# EAGLE design SparkFun NEO-M8U (EAGLE 9.6.2)
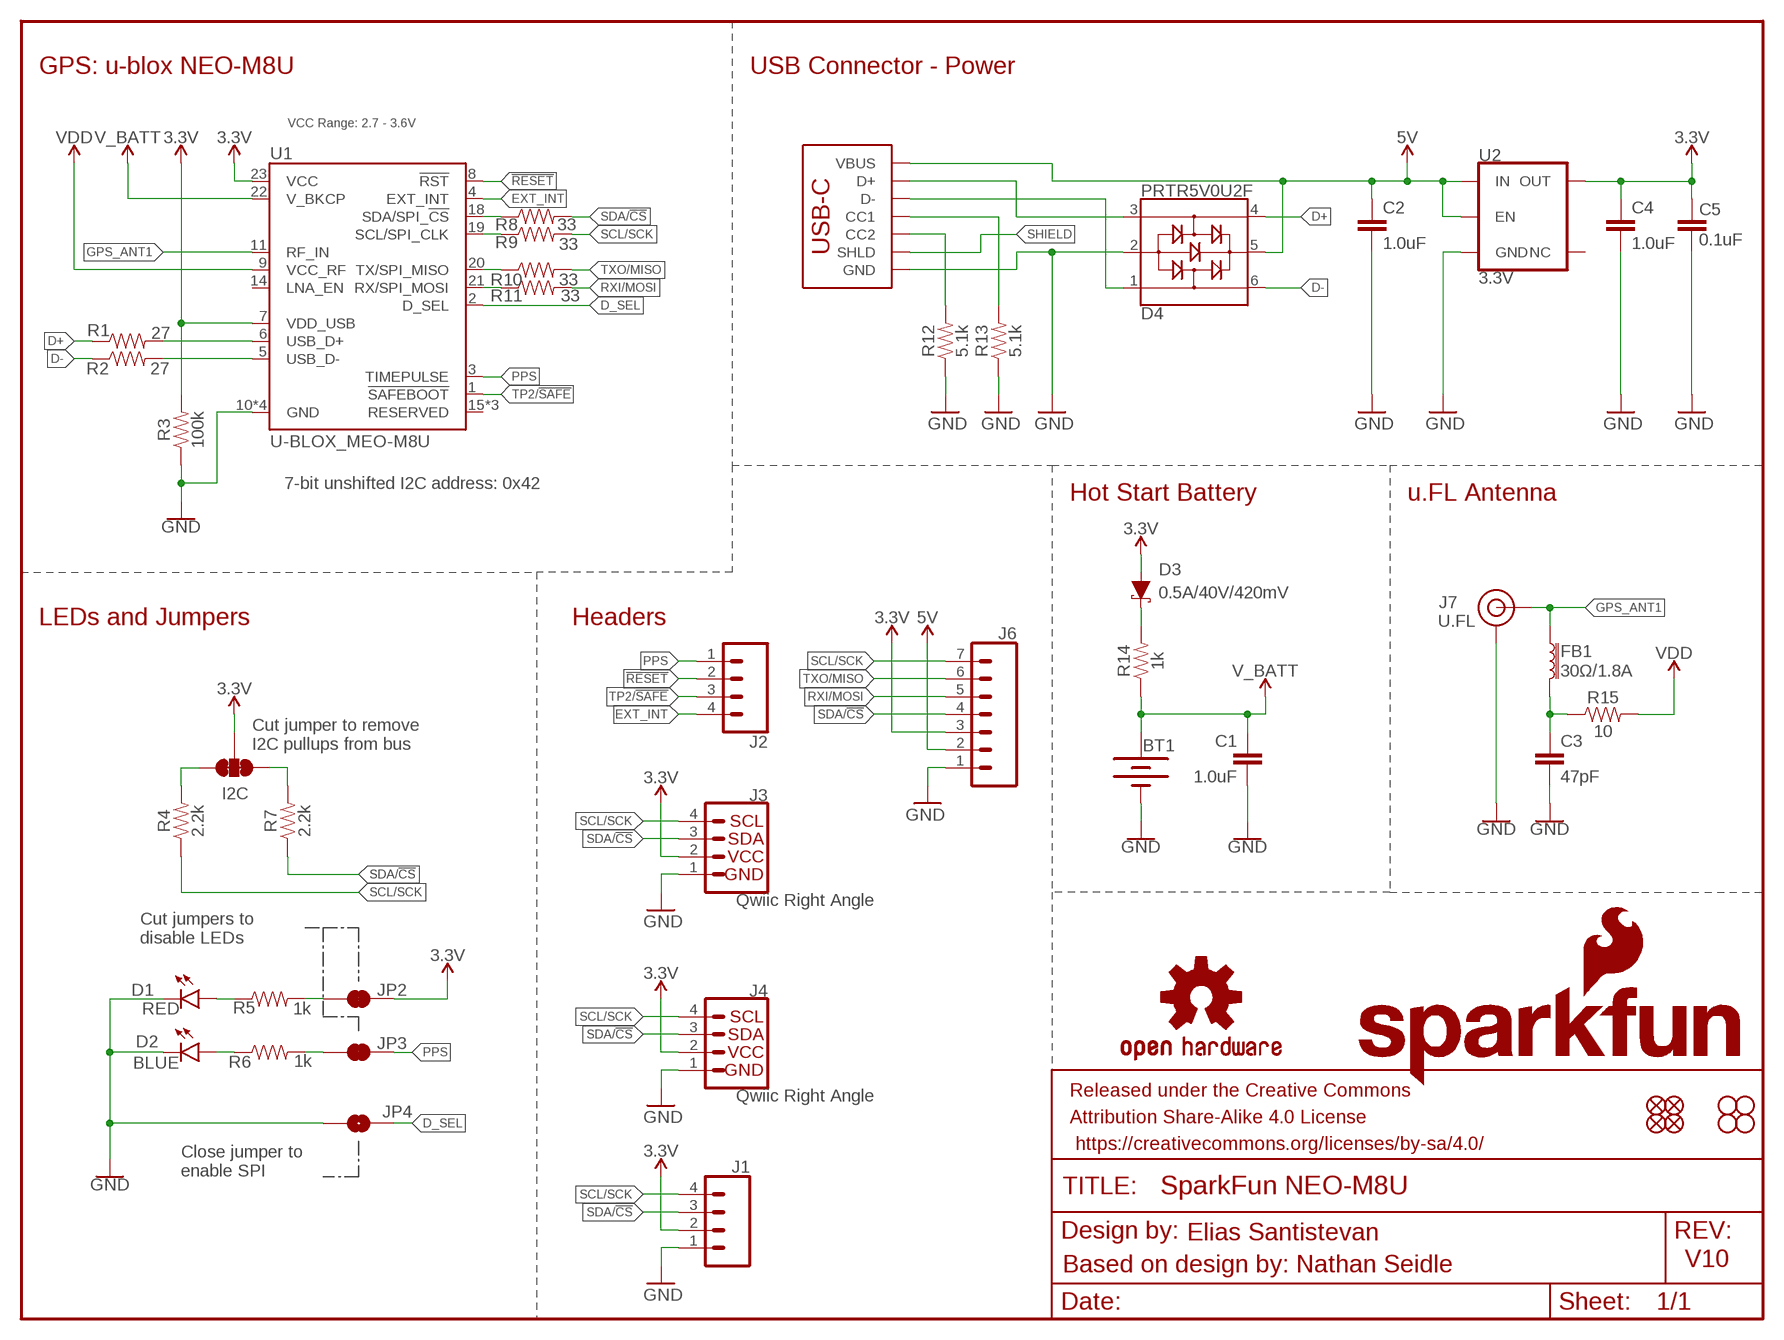
[diagram p0: schematic, sheet 1]

## Parts
BT1  6.8MM_COIN_CELL  ML414H_IV01E_BATTERY  [ML414H_IV01E]
C1  1.0uF  1.0UF-0603-16V-10%  [0603]
C2  1.0uF  1.0UF-0603-16V-10%  [0603]
C3  47pF  47PF-0603-50V-5%  [0603]
C4  1.0uF  1.0UF-0603-16V-10%  [0603]
C5  0.1uF  0.1UF-0603-25V-(+80/-20%)  [0603]
D1  RED  LED-RED0603  [LED-0603]
D2  BLUE  LED-BLUE0603  [LED-0603]
D3  0.5A/40V/420mV  DIODE-SCHOTTKY-PMEG4005EJ  [SOD-323]
D4  PRTR5V0U2F  [SOT886]
FB1  30Ω/1.8A  FERRITE_BEAD-0603  [0603]
FRAME1  FRAME-LETTER  [CREATIVE_COMMONS]
J1  CONN_041X04_NO_SILK  [1X04_NO_SILK]
J2  CONN_041X04_NO_SILK  [1X04_NO_SILK]
J3  Qwiic Right Angle  I2C_STANDARDQWIIC  [JST04_1MM_RA]
J4  Qwiic Right Angle  I2C_STANDARDQWIIC  [JST04_1MM_RA]
J5  USB_C_2-LAYER_PADS  [USB-C-16P-2LAYER-PADS]
J6  CONN_07NO_SILK  [1X07_NO_SILK]
J7  U.FL  U.FL2PIN  [U.FL]
JP1  JUMPER-SMT_3_2-NC_TRACE_SILK  [SMT-JUMPER_3_2-NC_TRACE_SILK]
JP2  JUMPER-SMT_2_NC_TRACE_SILK  [SMT-JUMPER_2_NC_TRACE_SILK]
JP3  JUMPER-SMT_2_NC_TRACE_SILK  [SMT-JUMPER_2_NC_TRACE_SILK]
JP4  JUMPER-SMT_2_NO_SILK  [SMT-JUMPER_2_NO_SILK]
JP5  FIDUCIALUFIDUCIAL  [MICRO-FIDUCIAL]
JP6  FIDUCIALUFIDUCIAL  [MICRO-FIDUCIAL]
JP7  FIDUCIALUFIDUCIAL  [MICRO-FIDUCIAL]
JP8  FIDUCIALUFIDUCIAL  [MICRO-FIDUCIAL]
JP9  STAND-OFF  [STAND-OFF]
JP10  STAND-OFF  [STAND-OFF]
JP11  STAND-OFF  [STAND-OFF]
JP12  STAND-OFF  [STAND-OFF]
LOGO1  OSHW-LOGOMINI  [OSHW-LOGO-MINI]
LOGO2  SFE_LOGO_NAME_FLAME.1_INCH  [SFE_LOGO_NAME_FLAME_.1]
R1  27  27OHM-0603-1/10W-1%  [0603]
R2  27  27OHM-0603-1/10W-1%  [0603]
R3  100k  100KOHM-0603-1/10W-1%  [0603]
R4  2.2k  2.2KOHM-0603-1/10W-1%  [0603]
R5  1k  1KOHM-0603-1/10W-1%  [0603]
R6  1k  1KOHM-0603-1/10W-1%  [0603]
R7  2.2k  2.2KOHM-0603-1/10W-1%  [0603]
R8  33  33OHM-0603-1/10W-1%  [0603]
R9  33  33OHM-0603-1/10W-1%  [0603]
R10  33  33OHM-0603-1/10W-1%  [0603]
R11  33  33OHM-0603-1/10W-1%  [0603]
R12  5.1k  5.1KOHM5.1KOHM-0603-1/10W-1%  [0603]
R13  5.1k  5.1KOHM5.1KOHM-0603-1/10W-1%  [0603]
R14  1k  1KOHM-0603-1/10W-1%  [0603]
R15  10  10OHM-0603-1/10W-1%  [0603]
U1  U-BLOX_MEO-M8U  [NEO-M9N/M8T/M8U]
U2  3.3V  V_REG_AP2112K-3.3V  [SOT23-5]

## Nets
3.3V [3.3V]: C4.1 C5.2 D3.A J1.2 J3.2 J4.2 J6.3 JP1.2 JP2.2 R3.2 U1.7(VDD_USB) U1.23(VCC) U2.5(OUT)
5V: C2.1 D4.5 J5.VBUS1(VBUS) J5.VBUS2(VBUS) J6.2 U2.1(IN) U2.3(EN)
!RESET: J2.2 U1.8(!RST)
ANT_VCC: C3.1 FB1.2 R15.1
D+: D4.4 R1.1
D-: D4.6 R2.1
D_SEL: JP4.2 U1.2(D_SEL)
EXT_INT: J2.4 U1.4(EXT_INT)
GND: BT1.- C1.2 C2.2 C3.2 C4.2 C5.1 D1.C D2.C D4.2 J1.1 J3.1 J4.1 J5.GND J5.GND2(GND) J6.1 J7.1(GND) J7.2(GND) JP4.1 R3.1 R12.1 R13.1 U1.10(GND) U1.12(GND) U1.13(GND) U1.24(GND) U2.2(GND)
GPS_ANT1: FB1.1 J7.FEED(SIGNAL) U1.11(RF_IN)
N$1: JP2.1 R5.2
N$2: D2.A R6.1
N$3: R8.1 U1.18(SDA/SPI_!CS!)
N$4: JP3.1 R6.2
N$5: JP1.1 R7.2
N$6: D3.C R14.2
N$7: J5.B5(CC2) R12.2
N$8: JP1.3 R4.2
N$9: J5.A5(CC1) R13.2
N$10: D1.A R5.1
N$11: R1.2 U1.6(USB_D+)
N$12: R2.2 U1.5(USB_D-)
N$13: R9.1 U1.19(SCL/SPI_CLK)
N$15: R10.1 U1.20(TX/SPI_MISO)
N$16: R11.1 U1.21(RX/SPI_MOSI)
PPS: J2.1 JP3.2 U1.3(TIMEPULSE)
RXI/MOSI: J6.5 R11.2
SCL/SCK: J1.4 J3.4 J4.4 J6.7 R4.1 R9.2
SDA/!CS: J1.3 J3.3 J4.3 J6.4 R7.1 R8.2
SHIELD: J5.SHLD1(SHLD) J5.SHLD2(SHLD) J5.SHLD3(SHLD) J5.SHLD4(SHLD)
TP2/!SAFE: J2.3 U1.1(!SAFEBOOT!)
TXO/MISO: J6.6 R10.2
USB_D+: D4.3 J5.A6(D+) J5.B6(D+)
USB_D-: D4.1 J5.A7(D-) J5.B7(D-)
V_BATT: BT1.+ C1.1 R14.1 U1.22(V_BKCP)
VDD: R15.2 U1.9(VCC_RF)
Unconnected: U1.14(LNA_EN) U1.15(RESERVED) U1.16(RESERVED) U1.17(RESERVED) U2.4(NC)

## Notes on the sheet
- GPS: u-blox NEO-M8U | USB Connector - Power
- VCC Range: 2.7 - 3.6V
- 7-bit unshifted I2C address: 0x42
- Hot Start Battery | u.FL Antenna
- LEDs and Jumpers | Headers
- Cut jumper to remove 
  I2C pullups from bus
- I2C
- Cut jumpers to 
  disable LEDs
- Close jumper to
  enable SPI
- Elias Santistevan
- Based on design by: Nathan Seidle | V10

## Library data of the parts
BT1 = SparkFun-Batteries:ML414H_IV01E_BATTERY: SEIKO ML414H-IV01E Reflowable Lithium Battery ML414H is a rechargeable, coin type battery with features such as Pb-free reflowable (Peak temperature: 260 C) and high temperature heat resistance. Battery Characteristics: 3.1V max voltage Voff is 2V 1mAH 3k series resistor with battery 72 hour charge time from 2.0-3.1V 2.3-2.8V initial charge; PROD_ID: BATT-14267
C1 C2 C4 = SparkFun-Capacitors:1.0UF: 1µF ceramic capacitors A capacitor is a passive two-terminal electrical component used to store electrical energy temporarily in an electric field.; PROD_ID: CAP-00868
C3 = SparkFun-Capacitors:47PF: 47pF ceramic capacitors A capacitor is a passive two-terminal electrical component used to store electrical energy temporarily in an electric field.; PROD_ID: CAP-08913
C5 = SparkFun-Capacitors:0.1UF: 0.1µF ceramic capacitors A capacitor is a passive two-terminal electrical component used to store electrical energy temporarily in an electric field.; PROD_ID: CAP-00810
D1 = SparkFun-LED:LED-RED: Red SMD LED Used in manufacturing of most products at SparkFun Packages: 0603 - SMD 0603 package [Product Link] <http://docs.avagotech.com/docs/AV02-0551EN> 0603 SMART - SMD 0603 SMART package ( more efficient and expensive)[Product Link] <http://www.osram-os.com/Graphics/XPic2/00077099_0.pdf> 1206 - SMD1206 package [Product Link] <https://www.sparkfun.com/datasheets/DevTools/LilyPad/Q150OVS4.pdff> SparkFun Products: Pro Mini 328 -5V <https://www.sparkfun.com/products/821> RedBoard <https://www.sparkfun.com/products/12757> IOIO-OTG <https://www.sparkfun.com/products/13613>; PROD_ID: DIO-00819
D2 = SparkFun-LED:LED-BLUE: Blue SMD LED Used in manufacturing of various products at SparkFun Packages: 0603 - SMD 0603 package [Product Link] <http://www.digikey.com/product-detail/en/SMLE12BC7TT86/511-1589-2-ND/1641808> 1206 - SMD1206 package [Product Link] <http://www.digikey.com/product-detail/en/lite-on-inc/LTST-C150TBKT/160-1643-1-ND/573584> SparkFun Products: ESP8266 Thing-Dev Board <https://www.sparkfun.com/products/13711> RedBoard <https://www.sparkfun.com/products/12757>; PROD_ID: DIO-08575
D3 = SparkFun-DiscreteSemi:DIODE-SCHOTTKY: Schottky diode A Schottky diode is a semiconductor diode which has a low forward voltage drop and a very fast switching action.; PROD_ID: DIO-10955
D4 = SparkFun-IC-Power:PRTR5V0U2: A small ESD protection device. Most commonly used on USB D+/D- signals to protect large, expensive, or especially sensitive USB enabled devices.; PROD_ID: DIO-14084
FB1 = SparkFun-Coils:FERRITE_BEAD: Ferrite Bead (blocks, cores, rings, chokes, etc.) Inductor with layers of ferrite used to suppress high frequencies. Often used to isolate high frequency noise. SparkFun Products: IOIO-OTG - V2.2 <https://www.sparkfun.com/products/13613> SparkFun SAMD21 Mini Breakout <https://www.sparkfun.com/products/13664> SparkFun 6 Degrees of Freedom Breakout - LSM6DS3 <https://www.sparkfun.com/products/13339> SparkFun SAMD21 Dev Breakout <https://www.sparkfun.com/products/13672>; PROD_ID: NDUC-13805
FRAME1 = SparkFun-Aesthetics:FRAME-LETTER: Schematic Frame - Letter Standard 8.5x11 US Letter frame
J1 J2 = SparkFun-Connectors:CONN_04: Multi connection point. Often used as Generic Header-pin footprint for 0.1 inch spaced/style header connections On any of the 0.1 inch spaced packages, you can populate with these: Break Away Headers - Straight <https://www.sparkfun.com/products/116> (PRT-00116) Break Away Male Headers - Right Angle <https://www.sparkfun.com/products/553> (PRT-00553) Female Headers <https://www.sparkfun.com/products/115> (PRT-00115) Break Away Headers - Machine Pin <https://www.sparkfun.com/products/117> (PRT-00117) Break Away Female Headers - Swiss Machine Pin <https://www.sparkfun.com/products/743> (PRT-00743) For SCREWTERMINALS and SPRING TERMINALS visit here: Screw Terimnals on SparkFun.com <https://www.sparkfun.com/search/results?term=Screw+Terminals> (5mm/3.5mm/2.54mm spacing) This device is also useful as a general connection point to wire up your design to another part of your project. Our various solder wires solder well into these plated through hole pads. Hook-Up Wire - Assortment (Stranded, 22 AWG) <https://www.sparkfun.com/products/11375> (PRT-11375) Hook-Up Wire - Assortment (Solid Core, 22 AWG) <https://www.sparkfun.com/products/11367> (PRT-11367) View the entire wire category on our website here <https://www.sparkfun.com/categories/141> Special notes: Molex polarized connector foot print use with SKU : PRT-08231 with associated crimp pins and housings. 1MM SMD Version SKU: PRT-10208; PROD_ID: CONN-09696
J3 J4 = SparkFun-Connectors:I2C_STANDARD: SparkFun I2C Standard Pinout Header SparkFun has standardized on a pinout for all I2C based sensor breakouts. This pinout allows I2C boards to be plugged directly into the headers on Arduino Uno compatible boards, and to be daisy chained easily. Example SparkFun Products: SparkFun Atmospheric Sensor Breakout - BME280 <https://www.sparkfun.com/products/13676> SparkFun Altitude/Pressure Sensor Breakout - MPL3115A2 <https://www.sparkfun.com/products/11084> SparkFun TOF Range Finder Sensor - VL6180 <https://www.sparkfun.com/products/12785>; PROD_ID: CONN-13694
J5 = SparkFun-Connectors:USB_C: USB Type C 16Pin Connector Super Speed pins not available on the 16-pin purely SMD connector so this part is best for USB 2.0 implementations. D1 and D2 are tied together enabling D+/- no matter which way the cable is plugged into the connector. The two channel configuration pins (CC1/2) are exposed. These are normally connected to ground via 5.1k resistors but can be reconfigured for high current/high power applications.; PROD_ID: CONN-14122
J6 = SparkFun-Connectors:CONN_07: Multi connection point. Often used as Generic Header-pin footprint for 0.1 inch spaced/style header connections On any of the 0.1 inch spaced packages, you can populate with these: Break Away Headers - Straight <https://www.sparkfun.com/products/116> (PRT-00116) Break Away Male Headers - Right Angle <https://www.sparkfun.com/products/553> (PRT-00553) Female Headers <https://www.sparkfun.com/products/115> (PRT-00115) Break Away Headers - Machine Pin <https://www.sparkfun.com/products/117> (PRT-00117) Break Away Female Headers - Swiss Machine Pin <https://www.sparkfun.com/products/743> (PRT-00743) For SCREWTERMINALS and SPRING TERMINALS visit here: Screw Terimnals on SparkFun.com <https://www.sparkfun.com/search/results?term=Screw+Terminals> (5mm/3.5mm/2.54mm spacing) This device is also useful as a general connection point to wire up your design to another part of your project. Our various solder wires solder well into these plated through hole pads. Hook-Up Wire - Assortment (Stranded, 22 AWG) <https://www.sparkfun.com/products/11375> (PRT-11375) Hook-Up Wire - Assortment (Solid Core, 22 AWG) <https://www.sparkfun.com/products/11367> (PRT-11367) View the entire wire category on our website here <https://www.sparkfun.com/categories/141> Special notes: Molex polarized connector foot print use with SKU : PRT-08231 with associated crimp pins and housings. 1MM SMD Version SKU: PRT-10208 NOTES ON THE VARIANTS LOCK and LOCK_LONGPADS... This footprint was designed to help hold the alignment of a through-hole component (i.e. 6-pin header) while soldering it into place. You may notice that each hole has been shifted either up or down by 0.005 of an inch from it's more standard position (which is a perfectly straight line). This slight alteration caused the pins (the squares in the middle) to touch the edges of the holes. Because they are alternating, it causes a "brace" to hold the component in place. 0.005 has proven to be the perfect amount of "off-center" position when using our standard breakaway headers. Although looks a little odd when you look at the bare footprint, once you have a header in there, the alteration is very hard to notice. Also,if you push a header all the way into place, it is covered up entirely on the bottom side.
J7 = SparkFun-Connectors:U.FL2PIN: SMD Antenna Connector - U.FL 2mm height, 3.0mm x 3.0mm receptacle size. SparkFun Products: SparkFun WiFi Shield - ESP8266 <https://www.sparkfun.com/products/13287> SparkFun ESP8266 Thing <https://www.sparkfun.com/products/13231> SparkFun MiniGen - Pro Mini Signal Generator Shield <https://www.sparkfun.com/products/11420>; PROD_ID: CONN-09193; SF_ID: WRL-09144
JP1 = SparkFun-Jumpers:JUMPER-SMT_3_2-NC_TRACE: Normally closed trace jumper (2 of 2 connections) This jumper has a trace between all three pads so they are normally closed (NC). Use a razor knife to open the connection(s). For best results follow the IPC guidelines for cutting traces: Cutout at least 0.063 mm (0.005 in). Remove all loose material to clean up the cut area. Seal the cut with an approved epoxy. Reapply solder to reclose the connection(s).
JP2 JP3 = SparkFun-Jumpers:JUMPER-SMT_2_NC_TRACE: Normally closed trace jumper This jumper has a trace between two pads so it's normally closed (NC). Use a razor knife to open the connection. For best results follow the IPC guidelines for cutting traces: Cutout at least 0.063 mm (0.005 in). Remove all loose material to clean up the cut area. Seal the cut with an approved epoxy. Reapply solder to reclose the connection.
JP4 = SparkFun-Jumpers:JUMPER-SMT_2_NO: Normally open jumper This jumper has two pads in close proximity to each other. Apply solder to close the connection. Round pads are easier to solder for beginners, but are a lot larger. SparkFun Product that uses the round pads: SparkFun EL Sequencer <https://www.sparkfun.com/products/12781>
JP5-JP8 = SparkFun:FIDUCIAL: Fiducial Alignment Points Various fiducial points for machine vision alignment.
JP9-JP12 = SparkFun:STAND-OFF: Stand Off This is the mechanical footprint for a #4 phillips button head screw. Use the keepout ring to avoid running the screw head into surrounding components. SKU : PRT-00447
LOGO1 = SparkFun-Aesthetics:OSHW-LOGO: Open-Source Hardware (OSHW) Logo This logo indicates the piece of hardware it is found on incorporates a OSHW license and/or adheres to the definition of open source hardware found here: http://freedomdefined.org/OSHW
LOGO2 = SparkFun-Aesthetics:SFE_LOGO_NAME_FLAME: SparkFun Font Logo w/ Flame This is the SparkFun full logo. The logo on the schematic will always be the same size; the package variant is the height of the flame part of the logo. Default layer for the logo on the board is tSilk.
R1 R2 = SparkFun-Resistors:27OHM: 27Ω resistor A resistor is a passive two-terminal electrical component that implements electrical resistance as a circuit element. Resistors act to reduce current flow, and, at the same time, act to lower voltage levels within circuits. - Wikipedia; PROD_ID: RES-09334
R3 = SparkFun-Resistors:100KOHM: 100kΩ resistor A resistor is a passive two-terminal electrical component that implements electrical resistance as a circuit element. Resistors act to reduce current flow, and, at the same time, act to lower voltage levels within circuits. - Wikipedia; PROD_ID: RES-07828
R4 R7 = SparkFun-Resistors:2.2KOHM: 2.2kΩ resistor A resistor is a passive two-terminal electrical component that implements electrical resistance as a circuit element. Resistors act to reduce current flow, and, at the same time, act to lower voltage levels within circuits. - Wikipedia; PROD_ID: RES-08272
R5 R6 R14 = SparkFun-Resistors:1KOHM: 1kΩ resistor A resistor is a passive two-terminal electrical component that implements electrical resistance as a circuit element. Resistors act to reduce current flow, and, at the same time, act to lower voltage levels within circuits. - Wikipedia; PROD_ID: RES-07856
R8-R11 = SparkFun-Resistors:33OHM: 33Ω resistor A resistor is a passive two-terminal electrical component that implements electrical resistance as a circuit element. Resistors act to reduce current flow, and, at the same time, act to lower voltage levels within circuits. - Wikipedia; PROD_ID: RES-08270
R12 R13 = SparkFun-Resistors:5.1KOHM; PROD_ID: RES-12083
R15 = SparkFun-Resistors:10OHM: 10Ω resistor A resistor is a passive two-terminal electrical component that implements electrical resistance as a circuit element. Resistors act to reduce current flow, and, at the same time, act to lower voltage levels within circuits. - Wikipedia; PROD_ID: RES-12581
U1 = SparkFun-GPS:U-BLOX_MEO-M8U: u-blox NEO-M8U The NEO-M8U module introduces u-blox’s Untethered Dead Reckoning (UDR) technology, which provides continuous navigation without requiring speed information from the vehicle. This innovative technology brings the benefits of dead reckoning to installations previously restricted to using GNSS alone, and significantly reduces the cost of installation for after-market dead reckoning applications. The strength of UDR is particularly apparent under poor signal conditions, where it brings continuous positioning in urban environments, even to devices with antennas installed within the vehicle. Useful positioning performance is also available during complete signal loss, for example in parking garages and short tunnels. With UDR, positioning starts as soon as power is applied to the module, before the first GNSS fix is available. The NEO-M8U may be installed in any position within the vehicle without configuration. In addition to its freedom from any electrical connection to the vehicle, the on-board accelerometer and gyroscope sensors result in a fully self-contained solution, perfect for rapid product development with reliable and consistent performance.; PROD_ID: IC-14850
U2 = SparkFun-IC-Power:V_REG_AP2112: AP2112 - 600mA CMOS LDO Regulator w/ Enable The AP2112 is CMOS process low dropout linear regulator with enable function, the regulator delivers a guaranteed 600mA (min.) continuous load current. Features Output Voltage Accuracy: ±1.5% Output Current: 600mA (Min.) Foldback Short Current Protection: 50mA Enable Function to Turn ON/OFF VOUT Low Dropout Voltage (3.3V): 250mV (Typ.) @IOUT=600mA Excellent Load Regulation: 0.2%/A (Typ.) Excellent Line Regulation: 0.02%/V (Typ.) Low Quiescent Current: 55μA (Typ.) Low Standby Current: 0.01μA (Typ.) Low Output Noise: 50μVRMS PSRR: 100Hz -65dB, 1kHz -65dB OTSD Protection Stable with 1.0μF Flexible Cap: Ceramic, Tantalum and Aluminum Electrolytic Operation Temperature Range: -40°C to 85°C ESD: MM 400V, HBM 4000V; PROD_ID: VREG-12457

## Net classes
1 vcc: width 0.152 mm
2 3.3V: width 0.508 mm

## Board
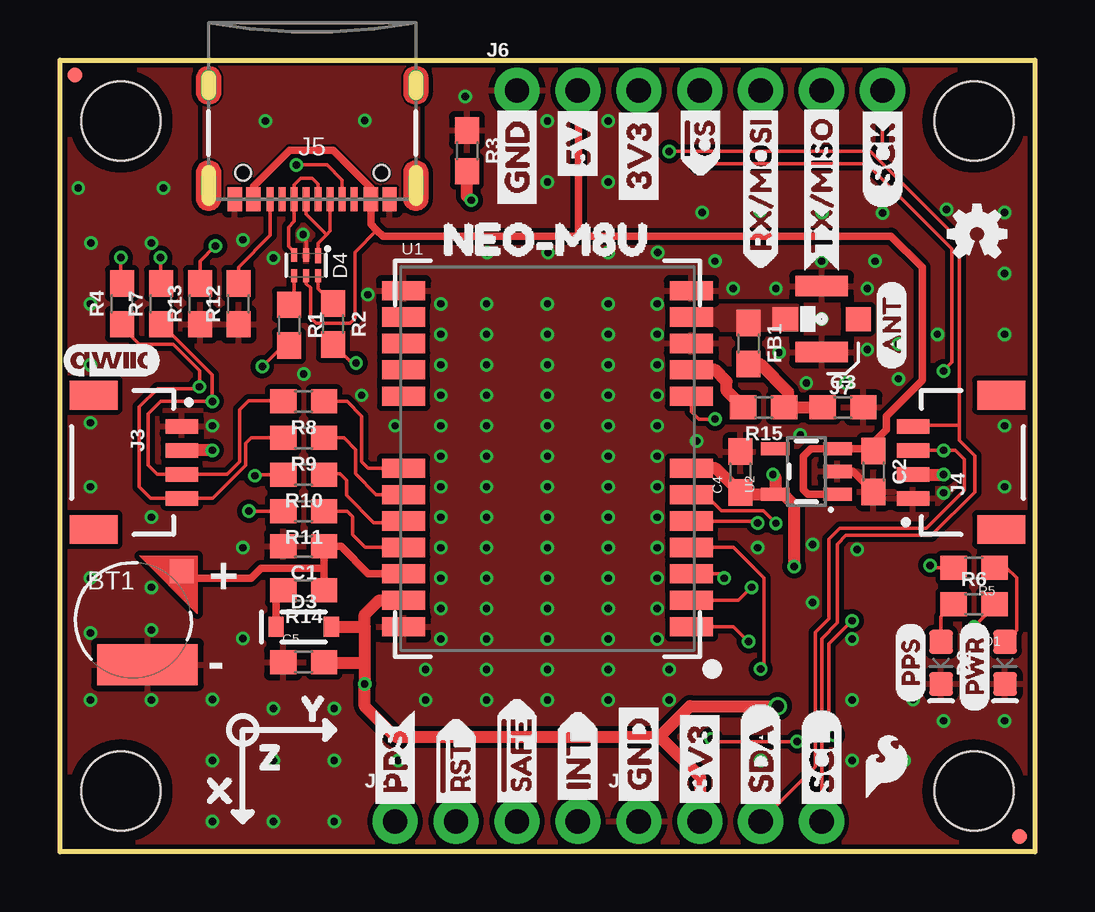
[diagram p1: board, top side]
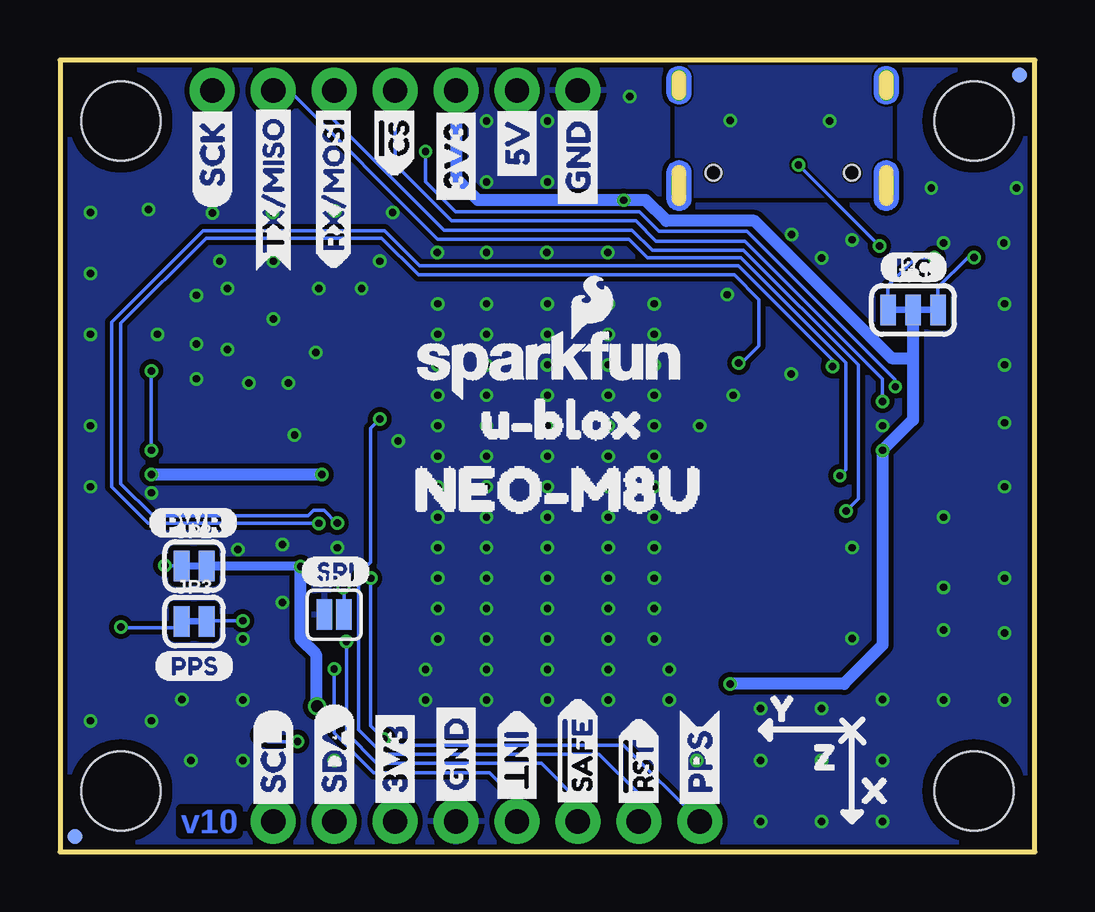
[diagram p2: board, bottom side, seen from below]

Size 40.64 x 32.99 mm. Coordinates in mm from the lower left corner, seen from the top.
Outline: 0,0 0,32.99 40.64,32.99 40.64,0 0,0
Copper layers (1*16): Top 0.035mm / dielectric 1.5mm / Bottom 0.035mm
Design rules "SparkFun-2-layer-FAB-LIMIT": minimum track width 4mil, minimum drill 6mil, track to track 4mil, track to pad 4mil, pad to pad 4mil, via to via 4mil, smd to smd 4mil, copper to edge 4mil, drill to drill 4mil, minimum pad ring 5mil, minimum via ring 5mil, stop-mask expansion 4mil, vias tented up to drill 25mil, thermal gap 10mil
bRestrict: area 29.2,8.8 to 30.1,9.1

### Footprints (pad centres in the part's own frame; a part is rotated, then mirrored left to right if it is on the bottom)
ML414H_IV01E = smd 1 x 1: + 2.022,2.032 | smd 4.2 x 1.7: - 0.6,-1.85
0603 = smd 1.1 x 1: 1 -0.85,0; 2 0.85,0
LED-0603 = smd 1 x 1: A -0.877,0; C 0.877,0
SOD-323 = smd 0.63 x 0.83: A 1.15,0; C -1.15,0
SOT886 = smd 0.61 x 0.25: 1 -0.405,0.5 | smd 0.56 x 0.25: 2 -0.43,0; 3 -0.43,-0.5; 4 0.43,-0.5; 5 0.43,0; 6 0.43,0.5
1X04_NO_SILK = drill 1.016 pad 1.88: 1 0,0; 2 2.54,0; 3 5.08,0; 4 7.62,0
JST04_1MM_RA = smd 0.6 x 1.35: 1 -1.5,0; 2 -0.5,0; 3 0.5,0; 4 1.5,0 | smd 1.2 x 2: NC1 2.8,-3.675; NC2 -2.8,-3.675
USB-C-16P-2LAYER-PADS = smd 0.3 x 1: A5 -1.25,-0.34; A6 -0.25,-0.34; A7 0.25,-0.34; A8 1.25,-0.34; B5 1.75,-0.34; B6 0.75,-0.34; B7 -0.75,-0.34; B8 -1.75,-0.34 | smd 0.6 x 1: GND -3.225,-0.34; GND2 3.225,-0.34; VBUS1 -2.45,-0.34; VBUS2 2.45,-0.34 | drill 0.4 pad 0.6 long: SHLD1 -4.318,-0.915; SHLD2 4.318,-0.915; SHLD3 -4.318,-5.095; SHLD4 4.318,-5.095 | hole 0.65: -2.89,-1.445; 2.89,-1.445
1X07_NO_SILK = drill 1.016 pad 1.88: 1 0,0; 2 2.54,0; 3 5.08,0; 4 7.62,0; 5 10.16,0; 6 12.7,0; 7 15.24,0
U.FL = smd 2.2 x 0.85: 1 0,1.375; 2 0,-1.375 | smd 1.05 x 1: FEED 1.525,0; NC -1.525,0
SMT-JUMPER_3_2-NC_TRACE_SILK = smd 0.66 x 1.27: 1 -1.041,0; 2 0,0; 3 1.041,0
SMT-JUMPER_2_NC_TRACE_SILK = smd 0.66 x 1.27: 1 -0.521,0; 2 0.521,0
SMT-JUMPER_2_NO_SILK = smd 0.635 x 1.27: 1 -0.406,0; 2 0.406,0
MICRO-FIDUCIAL = smd 0.635 x 0.635: 1 0,0
STAND-OFF = hole 3.302: 0,0
NEO-M9N/M8T/M8U = smd 1.8 x 0.8: 1 6,-7; 2 6,-5.9; 3 6,-4.8; 4 6,-3.7; 5 6,-2.6; 6 6,-1.5; 7 6,-0.4; 8 6,2.6; 9 6,3.7; 10 6,4.8; 11 6,5.9; 12 6,7; 13 -6,7; 14 -6,5.9; 15 -6,4.8; 16 -6,3.7; 17 -6,2.6; 18 -6,-0.4; 19 -6,-1.5; 20 -6,-2.6; 21 -6,-3.7; 22 -6,-4.8; 23 -6,-5.9; 24 -6,-7
SOT23-5 = smd 0.55 x 1.2: 1 -0.95,-1.3; 2 0,-1.3; 3 0.95,-1.3; 4 0.95,1.3; 5 -0.95,1.3

### Placement (x,y rotation side)
BT1  3.05,9.65 0 top
C1  10.16,12.73 180 top
C2  33.91,15.85 270 top
C3  32.64,18.52 0 top
C4  28.37,15.82 90 top
C5  10.16,7.9 0 top
D1  39.4,7.87 270 top
D2  36.73,7.87 270 top
D3  10.16,9.37 0 top
D4  10.26,24.43 270 top
FB1  28.7,21.18 270 top
FRAME1  -17.78,-17.78 0 top  (outside the outline)
J1  24.13,1.27 0 top
J2  13.97,1.27 0 top
J3  5.08,16.23 270 top
J4  35.56,16.23 90 top
J5  10.52,26.85 180 top
J6  19.05,31.72 0 top
J7  31.75,22.2 180 top
JP1  5.08,22.58 0 bottom
JP2  35.05,11.91 0 bottom
JP3  35.05,9.6 0 bottom
JP4  29.21,9.88 0 bottom
JP5  40.01,0.64 0 top
JP6  40.01,0.64 0 bottom
JP7  0.64,32.36 0 top
JP8  0.64,32.36 0 bottom
JP9  2.54,2.54 0 top
JP10  38.1,2.54 0 top
JP11  2.54,30.45 0 top
JP12  38.1,30.45 0 top
LOGO1  38.23,25.76 0 top
LOGO2  20.19,20.29 0 bottom
R1  9.55,21.95 270 top
R2  11.38,22 270 top
R3  16.97,29.21 270 top
R4  2.59,22.83 90 top
R5  38.1,11.84 180 top
R6  38.1,10.31 0 top
R7  4.22,22.83 90 top
R8  10.16,18.77 180 top
R9  10.16,17.25 180 top
R10  10.16,15.72 180 top
R11  10.16,14.2 180 top
R12  7.44,22.83 90 top
R13  5.84,22.83 90 top
R14  10.16,10.9 180 top
R15  29.34,18.52 180 top
U1  20.32,16.38 0 top
U2  31.11,15.85 90 top
U$1  [SDA-[)]  29.21,1.52 90 top
U$2  [INT1]  21.59,1.65 90 top
U$3  [SCL-[)]  31.75,1.52 90 top
U$4  [SDA-[)]  29.21,1.52 90 bottom
U$5  [SCL-[)]  31.75,1.52 90 bottom
U$6  [3V3-04]  26.67,1.52 90 top
U$7  [3V3-04]  26.67,1.52 90 bottom
U$8  [GND-04]  24.13,1.65 90 top
U$9  [GND-04]  24.13,1.65 90 bottom
U$10  [I_SUPER2_C-()-03]  6.48,24.36 0 bottom
U$11  [SPI1]  30.61,11.68 0 bottom
U$12  [PPS0]  36.7,7.75 0 bottom
U$13  [X1]  5.21,2.54 0 top
U$14  [QWIIC_4MM]  2.16,20.47 0 top
U$15  [NEO#M8U0]  27.43,15.11 0 bottom
U$16  [X1]  8.13,2.54 0 bottom
U$17  [PWR1]  36.96,13.72 0 bottom
U$18  [PWR-()-03]  38.13,5.84 90 top
U$19  [5V]  21.59,27.66 90 top
U$20  [5V]  21.59,27.66 90 bottom
U$21  [Y2]  11.94,5.97 0 bottom
U$22  [U#BLOX3]  24.51,18.01 0 bottom
U$23  [CS#-<]]  26.7,27.91 90 top
U$24  [CS#-<]]  26.7,27.91 90 bottom
U$25  [ANT0]  34.67,20.07 90 top
U$26  [RX#MOSI3]  29.21,24.23 90 top
U$27  [Y2]  9.14,5.97 0 top
U$28  [Z0]  7.37,3.94 0 top
U$29  [TX#MISO1]  31.75,24.13 90 top
U$30  [Z0]  10.16,3.94 0 bottom
U$31  [RX#MOSI3]  29.24,24.23 90 bottom
U$32  [INT0]  21.59,5.97 270 bottom
U$33  [SFE_LOGO_FLAME_.1]  34.44,3.58 0 top
U$34  [NEO#M8U0]  14.86,25.53 0 top
U$35  [#RST3]  16.51,1.4 90 top
U$36  [#RST3]  16.51,1.4 90 bottom
U$37  [TX#MISO1]  31.75,24.13 90 bottom
U$38  [SCK-(]-04]  34.29,26.8 90 top
U$39  [#SAFE1]  19.05,1.4 90 top
U$40  [#SAFE1]  19.05,1.4 90 bottom
U$41  [SCK-(]-04]  34.29,26.8 90 bottom
U$43  [PPS5]  13.97,1.52 90 top
U$44  [PPS5]  13.97,1.52 90 bottom
U$52  [PPS0]  35.46,6.22 90 top
U$60  [3V3-04]  24.13,26.64 90 bottom
U$61  [3V3-04]  24.13,26.64 90 top
U$62  [GND-04]  19.05,26.52 90 bottom
U$63  [GND-04]  19.05,26.52 90 top

### Tracks (layer width: path | path; a pad name or v marks a point on that pad's centre or on a via)
3.3V  (via drill 0.3, 0.51)
  Top 0.508: v6.35,16.73 J3.2 | U2.5 29.79,14.87 28.47,14.87 C4.1 28.35,14.97 27.34,15.98 U1.7 | v29.72,15.72 29.82,15.63 U2.5 | J4.2 v36.83,15.72 | v30.61,11.89 30.61,14.45 30.16,14.9 U2.5 | 25.02,4.8 25.01,4.81 26.26,6.07 v29.92,6.07 | 25.02,4.8 26.67,3.15 J1.2 | 25.02,4.8 13.97,4.8 12.7,6.07 v12.7,7 12.7,7.87 | 12.7,9.37 12.7,9.88 13.3,10.48 U1.23 | 12.7,9.37 12.7,7.87 | D3.A 12.7,9.37 | v17.14,27.15 16.97,27.33 R3.2 | C5.2 11.04,7.87 12.7,7.87
  Bottom 0.381: JP2.2 30.63,11.91
  Bottom 0.508: v29.72,15.72 v36.83,15.72 | J6.3 24.13,28.07 23.22,27.15 v17.14,27.15 16.23,27.15 15.37,26.29 11.69,26.29 5.97,20.57 5.08,20.57 | v29.92,6.07 29.97,6.12 29.97,8.23 30.61,8.87 v30.61,11.89 30.63,11.91 | JP1.2 5.08,20.57 | 5.08,20.57 5.08,18 v6.35,16.73 6.35,15.24 6.35,8.61 7.96,7 v12.7,7
5V
  Top 0.152: D4.5 10.26,23.67 10.44,23.5 10.44,22.25 10.67,22.02 12.09,22.02 12.29,22.22 12.29,24.99 13.21,25.91
  Top 0.254: C2.1 33.73,16.7 33.63,16.8
  Top 0.305: 21.61,25.65 34.65,25.65 35.94,24.36 35.94,19.64 34.45,18.16 34.45,17.59 33.91,17.04 C2.1 | 33.63,16.8 U2.3 31.3,16.8 30.99,16.48 30.99,15.09 31.18,14.9 U2.1 | J5.VBUS2 8.07,27.73 9.58,29.23 11.38,29.23 12.97,27.65 J5.VBUS1 12.97,26.15 13.21,25.91 13.46,25.65 21.61,25.65 | J6.2 21.61,31.7 21.61,25.65
!RESET  (via drill 0.3)
  Top 0.152: v27.3,18.03 26.63,18.03 26.32,18.35 U1.8
  Bottom 0.152: J2.2 16.51,2.41 18.16,4.06 27.18,4.06 28.19,5.08 28.19,11.56 27.69,12.06 27.69,17.65 v27.3,18.03
ANT_VCC
  Top 0.305: R15.1 30.35,18.52
  Top 0.508: C3.1 30.35,18.52 30.35,19.15 29.17,20.33 FB1.2
D+
  Top 0.152: R1.1 9.76,23.01 D4.4
D-
  Top 0.152: R2.1 10.76,23.46 D4.6
D_SEL  (via drill 0.3)
  Top 0.152: U1.2 28.29,10.48 v28.83,11.02
  Bottom 0.152: JP4.2 28.8,11 v28.83,11.02
EXT_INT  (via drill 0.3)
  Top 0.152: v29.21,7.62 29.34,7.75 29.34,11.43 28.07,12.7 26.34,12.7 U1.4
  Bottom 0.152: J2.4 21.59,2.16 22.73,3.3 27.56,3.3 29.21,4.95 v29.21,7.62
GND  (via drill 0.3)
  Top 0.152: D4.2 10.26,25.6 v10.13,25.73
  Top 0.305: U2.2 33.06,15.85 C2.2
  other vias: 6.35,17.75 33.22,12.6 15.88,8.86 17.78,8.86 12.83,23.22 36.83,14.96 20.32,8.86 22.86,8.86 24.89,8.86 15.88,10.13 17.78,10.13 20.32,10.13 22.86,10.13 24.89,10.13 15.88,11.4 17.78,11.4 20.32,11.4 22.86,11.4 24.89,11.4 15.88,12.67 17.78,12.67 20.32,12.67 22.86,12.67 24.89,12.67 15.88,13.94 17.78,13.94 20.32,13.94 22.86,13.94 24.89,13.94 15.88,15.21 17.78,15.21 20.32,15.21 22.86,15.21 24.89,15.21 15.88,16.48 17.78,16.48 20.32,16.48 22.86,16.48 24.89,16.48 15.88,17.75 17.78,17.75 20.32,17.75 22.86,17.75 24.89,17.75 15.88,19.02 17.78,19.02 20.32,19.02 22.86,19.02 24.89,19.02 15.88,20.29 17.78,20.29 20.32,20.29 22.86,20.29 24.89,20.29 15.88,21.56 17.78,21.56 20.32,21.56 22.86,21.56 24.89,21.56 15.88,22.83 17.78,22.83 20.32,22.83 22.86,22.83 24.89,22.83 31.11,19.53 33.66,20.93 33.66,23.47 36.58,21.56 34.29,26.62 22.86,27.91 22.86,30.45 31.75,22.2 26.54,17.12 35.18,3.81 6.35,3.81 6.35,1.27 1.3,25.37 0.76,27.66 1.27,15.21 1.27,17.88 1.27,20.29 1.27,22.83 1.27,6.32 1.27,11.4 3.81,6.32 3.81,9.25 3.81,11.02 17.78,6.32 20.32,6.32 22.86,6.32 25.4,6.32 3.81,25.37 4.32,27.66 13.97,17.75 12.57,19.02 33.02,3.81 3.81,13.94 32.77,19.53 29.21,24.61 31.75,24.61 27.3,24.61 8.89,1.27 11.43,3.81 8.89,3.81 33.02,6.32 11.43,1.27 29.08,12.67 39.37,26.64 36.96,26.77 39.37,24.1 22.86,24.97 17.81,24.97 20.35,24.97 24.92,24.97 26.77,26.64 29.18,26.7 34.95,21.16 34.95,23.19 33.99,24.61 34.95,19.71 31.78,26.64 8.89,24.74 39.37,5.46 36.83,5.46 39.37,21.56 39.37,17.75 39.37,15.21 28.07,23.47 20.32,30.45 20.32,27.91 16.89,31.47 29.21,3.81 14.1,3.81 7.62,25.5 29.84,23.47 29.97,20.8 33.02,8.86 35.56,6.35 17.78,7.59 20.32,7.59 22.86,7.59 25.4,7.59 30.86,17.37 11.43,5.97 8.89,5.97 6.35,6.35 1.27,9.12 7.62,12.67 10.16,19.91 15.24,6.32 15.24,7.59 7.62,8.89 31.37,12.8 31.37,10.39
  pour Top (isolate 0.203, rank 4): 0,32.99 40.64,32.99 40.64,0 0,0
  pour Bottom (isolate 0.203, rank 4): 0,32.99 40.64,32.99 40.64,0 0,0
GPS_ANT1
  pour Top (isolate 0.3, no thermals): 25.49,22.75 25.49,21.75 30.74,21.75 30.74,22.75
N$1  (via drill 0.3)
  Top 0.152: R5.2 36.37,11.84 v36.27,11.94
  Bottom 0.152: v36.27,11.94 36.25,11.91 JP2.1
N$2
  Top 0.152: D2.A 36.73,9.79 R6.1
N$3
  Top 0.152: U1.18 12.85,15.98 12.57,16.26 12.57,18.16 11.96,18.77 R8.1
N$4  (via drill 0.3)
  Top 0.152: R6.2 38.95,10.22 v38.1,9.37
  Bottom 0.152: v38.1,9.37 38.08,9.35 35.83,9.35 JP3.1
N$5  (via drill 0.3)
  Top 0.152: v4.19,24.77 4.19,23.71 R7.2
  Bottom 0.152: v4.19,24.77 4.95,24.77 6.12,23.6 JP1.1
N$6
  Top 0.152: 9.01,10.6 R14.2
  Top 0.305: D3.C 9.01,10.6
N$7
  Top 0.152: J5.B5 8.77,25.69 7.44,24.36 R12.2
N$8  (via drill 0.3)
  Top 0.152: v2.54,24.77 2.54,23.73 R4.2
  Bottom 0.152: JP1.3 4.04,23.52 2.79,24.77 v2.54,24.77
N$9  (via drill 0.3)
  Top 0.152: J5.A5 11.77,27.98 11.12,28.63 v9.86,28.63 | v6.48,25.25 5.84,24.61 R13.2
  Bottom 0.152: v9.86,28.63 v6.48,25.25
N$10
  Top 0.152: R5.1 39.46,11.84 39.88,11.42 39.88,9.23 D1.A
N$11  (via drill 0.3)
  Top 0.152: R1.2 9.31,21.1 v8.43,20.22 | v29.84,13.69 29.32,14.22 27.57,14.22 26.91,14.88 U1.6
  Bottom 0.152: v29.84,13.69 36.96,13.69 38.48,15.21 38.48,22.07 34.67,25.88 27.1,25.88 25.64,24.42 12.36,24.42 8.43,20.5 v8.43,20.22
N$12  (via drill 0.3)
  Top 0.152: R2.2 12.15,20.37 v12.34,20.37 | U1.5 29,13.78 v29.08,13.7
  Bottom 0.152: v29.08,13.7 29.1,13.7 29.62,14.22 30.07,14.22 30.3,13.99 36.75,13.99 38.1,15.34 38.1,22.02 34.55,25.58 27.23,25.58 25.69,24.04 12.53,24.04 11.51,23.01 11.51,21.08 12.22,20.37 v12.34,20.37
N$13
  Top 0.152: U1.19 13.18,14.88 12.32,15.75 12.32,16.76 11.84,17.25 R9.1
N$15
  Top 0.152: R10.1 11.05,15.75 11.68,15.75 11.94,15.49 11.94,14.86 13.08,13.72 14.25,13.72 U1.20
N$16
  Top 0.152: U1.21 12.72,12.68 12.19,13.21 12.19,13.97 11.96,14.2 R11.1
PPS  (via drill 0.3)
  Top 0.152: v33.02,9.63 32.05,8.66 32.05,5.05 v32.24,4.87 | v30.73,4.6 27.25,4.6 v27.14,4.71 | U1.3 27.51,11.58 v27.69,11.4
  Bottom 0.152: v33.02,9.63 34.52,9.63 34.53,9.61 JP3.2 | v32.24,4.87 31.96,4.59 v30.74,4.59 v30.73,4.6 | v27.69,11.4 27.69,5.25 v27.14,4.71 26.88,4.45 17.14,4.45 J2.1
RXI/MOSI  (via drill 0.3)
  Top 0.152: R11.2 v7.87,14.2
  Bottom 0.152: v7.87,14.2 7.37,14.71 7.37,20.3 12.14,25.07 15.95,25.07 16.79,25.91 24.64,25.91 29.21,30.48 J6.5
SCL/SCK  (via drill 0.3)
  Top 0.152: v25.4,29.18 33.78,29.18 34.02,28.94 | R4.1 2.59,21.86 3.3,21.15 4.72,21.15 5.82,20.05 v5.82,19.38 5.74,19.3 4.06,19.3 3.3,18.54 3.3,15.21 3.79,14.73 J3.4 6.37,14.73 7.75,16.1 7.75,17.02 7.98,17.25 R9.2 | 37.49,17.78 37.49,17.14 38.13,16.51 38.13,14.99 36.32,13.18 32.77,13.18 32.4,12.81 32.4,9.54 31.75,8.89 J1.4 | 37.49,17.78 37.49,25.48 34.02,28.94 | J4.4 35.61,17.78 37.49,17.78 | J6.7 34.29,29.21 34.02,28.94
  Bottom 0.152: v25.4,29.18 25.4,27.91 24.16,26.67 16.49,26.67 15.67,25.86 12.01,25.86 5.84,19.68 5.84,19.4 v5.82,19.38
SDA/!CS  (via drill 0.3)
  Top 0.152: R8.2 9.14,18.77 9.12,18.8 7.87,18.8 7.49,18.41 7.49,16.26 6.97,15.73 J3.3 4.06,15.73 3.68,16.1 3.68,18.26 4.19,18.77 v6.35,18.77 6.35,19.88 4.24,21.98 R7.1 | J4.3 v36.83,16.73 37.33,16.73 37.69,16.37 37.69,15.06 36.12,13.49 32.51,13.49 32.05,13.03 32.05,9.7 31.5,9.14 31.5,3.56 J1.3 | v26.67,28.68 33.63,28.68 37.19,25.12 37.19,20.4 v36.83,20.04
  Bottom 0.152: v6.35,18.77 6.35,19.71 12.09,25.45 15.8,25.45 16.64,26.29 24.31,26.29 26.67,28.65 v26.67,28.68 J6.4 | v36.83,16.73 v36.83,20.04
SHIELD  (via drill 0.3)
  other vias: 8.56,30.45 12.7,30.48
  pour Top (no thermals): 5.97,33.02 5.97,27.3 14.99,27.3 14.99,33.02
  pour Bottom (no thermals): 14.99,33.02 14.99,27.3 5.97,27.3 5.97,33.02
TP2/!SAFE  (via drill 0.3)
  Top 0.152: v28.7,8.76 28.08,9.38 U1.1
  Bottom 0.152: J2.3 19.05,2.16 20.57,3.68 27.43,3.68 28.7,4.95 v28.7,8.76
TXO/MISO  (via drill 0.3)
  Top 0.152: R10.2 8.18,15.72 v8.13,15.67
  Bottom 0.152: v8.13,15.67 7.87,15.93 7.87,20.37 12.26,24.75 16.14,24.75 16.92,25.53 24.89,25.53 31.09,31.73 J6.6
USB_D+
  Top 0.152: J5.A6 10.77,27.82 10.52,28.07 10.03,28.07 9.77,27.8 J5.B6 9.77,26.28 9.53,26.04 9.53,25.23 9.76,24.99 D4.3
USB_D-
  Top 0.152: J5.B7 11.27,25.87 11.11,25.72 | D4.1 10.76,25.37 11.11,25.72 | J5.A7 10.27,26.56 11.11,25.72
V_BATT
  Top 0.305: BT1.+ 5.35,11.4 7.98,11.4 8.38,11.81 11.01,11.81 | 11.01,11.81 C1.1 11.71,12.72 12.85,11.58 U1.22 | 11.01,11.81 R14.1
VDD
  Top 0.508: R15.2 27.79,19.22 27.79,19.61 27.31,20.08 U1.9

### Text on the board
Bottom: v10
tPlace: + | -
Measures: Measurements in inches
tDocu: Elias Santistevan